# EAGLE schematic usbspi (EAGLE 9.3.0)
CREVISION: hv0a; DESIGNER: Rafael Silva
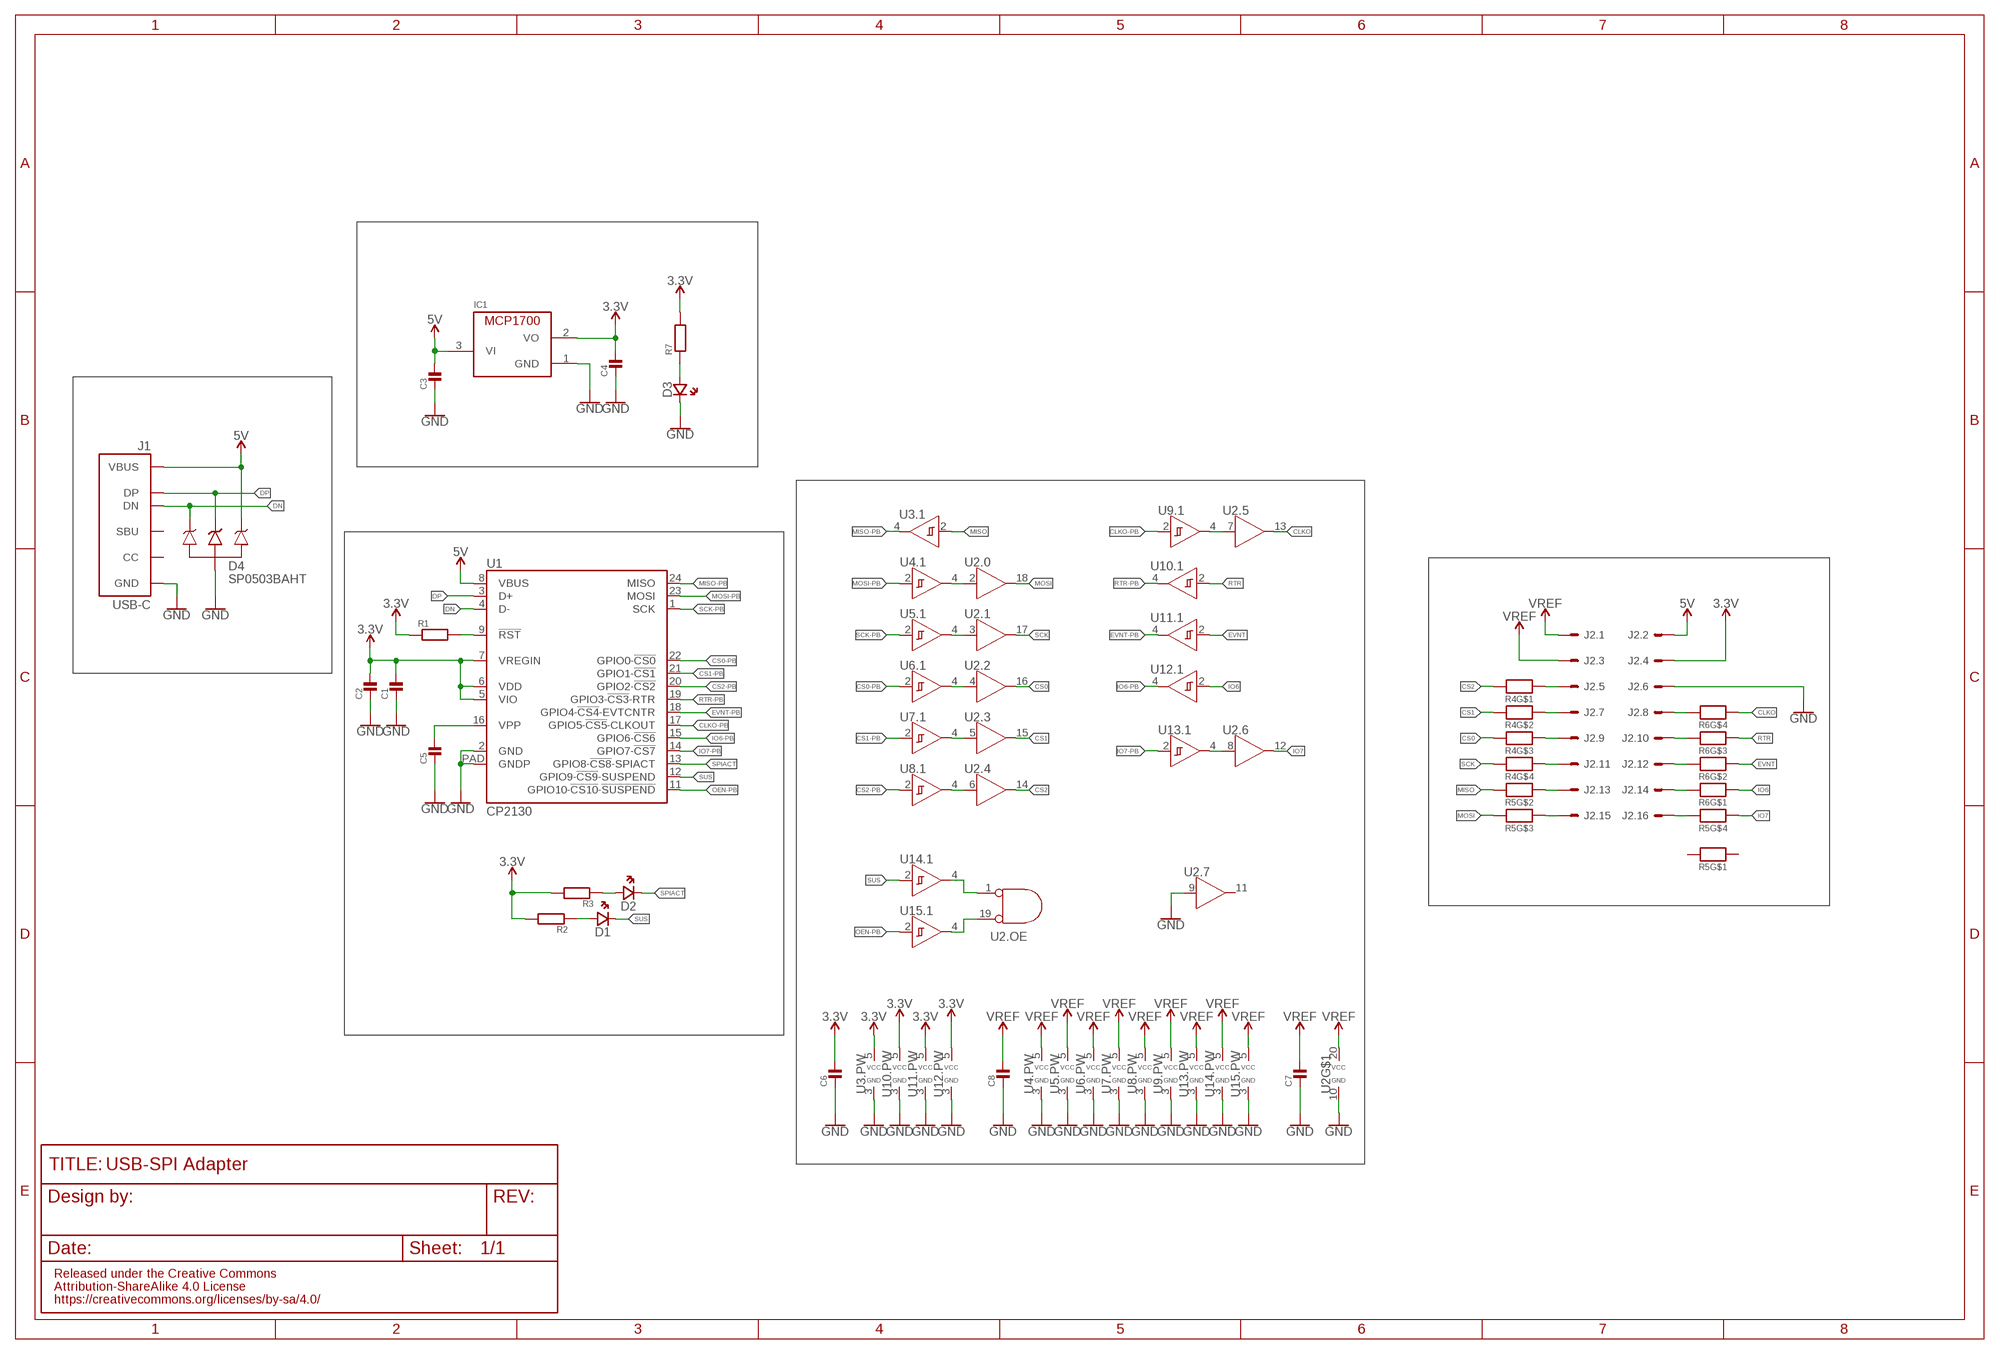
[diagram p0: schematic, sheet 1]

## Parts
C1  MLCC0603  [0603_WAVE]
C2  MLCC0603  [0603_WAVE]
C3  MLCC0603  [0603_WAVE]
C4  MLCC0603  [0603_WAVE]
C5  MLCC0603  [0603_WAVE]
C6  MLCC0603  [0603_WAVE]
C7  MLCC0603  [0603_WAVE]
C8  MLCC0603  [0603_WAVE]
D1  LED0603  [CHIPLED_0603]
D2  LED0603  [CHIPLED_0603]
D3  LED0603  [CHIPLED_0603]
D4  SP0503BAHT  [SOT143]
IC1  MCP1700T-3302TT  [SOT-23]
J1  USB-C  [USB-C]
J2  2X8  [2X8_2.54]
R1  RESISTOR0603  [0603_WAVE]
R2  RESISTOR0603  [0603_WAVE]
R3  RESISTOR0603  [0603_WAVE]
R4  RESISTOR_4PACK  [RESPACK_4X0603]
R5  RESISTOR_4PACK  [RESPACK_4X0603]
R6  RESISTOR_4PACK  [RESPACK_4X0603]
R7  RESISTOR0603  [0603_WAVE]
U1  CP2130  [QFN24]
U2  74HC541  [TSSOP20]
U3  74LVC1G17  [SC70-5]
U4  74LVC1G17  [SC70-5]
U5  74LVC1G17  [SC70-5]
U6  74LVC1G17  [SC70-5]
U7  74LVC1G17  [SC70-5]
U8  74LVC1G17  [SC70-5]
U9  74LVC1G17  [SC70-5]
U10  74LVC1G17  [SC70-5]
U11  74LVC1G17  [SC70-5]
U12  74LVC1G17  [SC70-5]
U13  74LVC1G17  [SC70-5]
U14  74LVC1G17  [SC70-5]
U15  74LVC1G17  [SC70-5]

## Nets
3.3V: C1.P$1 C2.P$1 C4.P$1 C6.P$1 IC1.2(VO) J2.4 R1.P$1 R2.P$2 R3.P$2 R7.P$2 U1.5(VIO) U1.6(VDD) U1.7(VREGIN) U3.5(.PW:VCC) U10.5(.PW:VCC) U11.5(.PW:VCC) U12.5(.PW:VCC)
5V: C3.P$1 D4.4 IC1.3(VI) J1.A4_B9(VBUS) J1.B4_A9(VBUS) J2.2 U1.8(VBUS)
CLKO: R6.4 U2.13(.5:Y)
CLKO-PB: U1.17(GPIO5-!CS5!-CLKOUT) U9.2(.1:A)
CS0: R4.6 U2.16(.2:Y)
CS0-PB: U1.22(GPIO0-!CS0) U6.2(.1:A)
CS1: R4.7 U2.15(.3:Y)
CS1-PB: U1.21(GPIO1-!CS1) U7.2(.1:A)
CS2: R4.8 U2.14(.4:Y)
CS2-PB: U1.20(GPIO2-!CS2) U8.2(.1:A)
DN: D4.2 J1.A7(DN) J1.B7(DN) U1.4(D-)
DP: D4.3 J1.A6(DP) J1.B6(DP) U1.3(D+)
EVNT: R6.2 U11.2(.1:A)
EVNT-PB: U1.18(GPIO4-!CS4!-EVTCNTR) U11.4(.1:Y)
GND: C1.P$2 C2.P$2 C3.P$2 C4.P$2 C5.P$2 C6.P$2 C7.P$2 C8.P$2 D3.C(CA) D4.1 IC1.1(GND) J1.A1_B12(GND) J1.B1_A12(GND) J1.SHIELD@0(GND) J1.SHIELD@1(GND) J2.6 U1.2(GND) U1.PAD(GNDP) U2.9(.7:A) U2.10(GND) U3.3(.PW:GND) U4.3(.PW:GND) U5.3(.PW:GND) U6.3(.PW:GND) U7.3(.PW:GND) U8.3(.PW:GND) U9.3(.PW:GND) U10.3(.PW:GND) U11.3(.PW:GND) U12.3(.PW:GND) U13.3(.PW:GND) U14.3(.PW:GND) U15.3(.PW:GND)
IO6: R6.1 U12.2(.1:A)
IO6-PB: U1.15(GPIO6-!CS6) U12.4(.1:Y)
IO7: R5.4 U2.12(.6:Y)
IO7-PB: U1.14(GPIO7-!CS7) U13.2(.1:A)
MISO: R5.7 U3.2(.1:A)
MISO-PB: U1.24(MISO) U3.4(.1:Y)
MOSI: R5.6 U2.18(.0:Y)
MOSI-PB: U1.23(MOSI) U4.2(.1:A)
N$1: U2.19(.OE:B) U15.4(.1:Y)
N$2: D1.A(AN) R2.P$1
N$3: D2.A(AN) R3.P$1
N$4: R1.P$2 U1.9(!RST)
N$5: U2.1(.OE:A) U14.4(.1:Y)
N$6: J2.13 R5.2
N$7: U2.2(.0:A) U4.4(.1:Y)
N$8: C5.P$1 U1.16(VPP)
N$9: D3.A(AN) R7.P$1
N$10: U2.3(.1:A) U5.4(.1:Y)
N$11: U2.4(.2:A) U6.4(.1:Y)
N$12: U2.5(.3:A) U7.4(.1:Y)
N$13: U2.6(.4:A) U8.4(.1:Y)
N$14: U2.8(.6:A) U13.4(.1:Y)
N$15: U2.7(.5:A) U9.4(.1:Y)
N$16: J2.15 R5.3
N$17: J2.11 R4.4
N$18: J2.9 R4.3
N$19: J2.7 R4.2
N$20: J2.5 R4.1
N$21: J2.8 R6.5
N$22: J2.10 R6.6
N$23: J2.12 R6.7
N$24: J2.14 R6.8
N$25: J2.16 R5.5
OEN-PB: U1.11(GPIO10-!CS10!-!SUSPEND) U15.2(.1:A)
RTR: R6.3 U10.2(.1:A)
RTR-PB: U1.19(GPIO3-!CS3!-RTR) U10.4(.1:Y)
SCK: R4.5 U2.17(.1:Y)
SCK-PB: U1.1(SCK) U5.2(.1:A)
SPIACT: D2.C(CA) U1.13(GPIO8-!CS8!-SPIACT)
SUS: D1.C(CA) U1.12(GPIO9-!CS9!-SUSPEND) U14.2(.1:A)
VREF: C7.P$1 C8.P$1 J2.1 J2.3 U2.20(VCC) U4.5(.PW:VCC) U5.5(.PW:VCC) U6.5(.PW:VCC) U7.5(.PW:VCC) U8.5(.PW:VCC) U9.5(.PW:VCC) U13.5(.PW:VCC) U14.5(.PW:VCC) U15.5(.PW:VCC)
Unconnected: J1.A5(CC) J1.A8(SBU) J1.B5(CC) J1.B8(SBU) R5.1 R5.8 U2.11(.7:Y)

## Notes on the sheet
- USB-SPI Adapter

## Library data of the parts
C1-C8 = Passive Components > Capacitors > Multilayer Ceramic Capacitors MLCC:MLCC: KEMET’s X7R dielectric features a 125°C maximum operating temperature and is considered temperature stable. The Electronics Components, Assemblies and Materials Association (EIA) characterizes X7R dielectric as a Class II material. Components of this classification are fixed, ceramic dielectric capacitors suited for bypass and decoupling applications or for frequency discriminating circuits where Q and stability of capacitance characteristics are not critical. X7R exhibits a predictable change in capacitance with respect to time and voltage, boasting a minimal change in capacitance with reference to ambient temperature. Capacitance change is limited to ±15% from −55°C to +125°C.
D1-D3 = Opto-electronics > LED Emitters:LED: LED 0603 - 0603 Surface Mount Package 2mA: Green LED - Low Power (3.9mcd, 2ma, 1.7Vf) - Digikey: 475-2709-2-ND Orange LED - Low Power (9.8mcd, 2ma, 1.8Vf) - Digikey: 475-1194-2-ND Red LED - Low Power (5mcd, 2ma, 1.8Vf) - Digikey: 475-1195-2-ND Yellow LED - Low Power (7mcd, 2ma, 1.8Vf) - Digikey: 475-1196-2-ND 5mA: Blue LED - Low Power (17mcd, 5ma, 2.9Vf) - Digikey: LNJ937W8CRACT-ND 0805 - 0805 Surface Mount Package 2mA: Red LED (8.8mcd, 2mA, 1.8Vf, Clear) - Low Power [Digikey: 475-2510-1-ND] Green LED (5mcd, 2mA, 1.8Vf, Clear) - Low Power [Digikey: 475-2730-1-ND] Yellow LED (11.3mcd, 2mA, 1.8Vf, Clear) - Low Power [Digikey: 475-2555-1-ND] 20mA: Red LED (104mcd, 20mA, Diffused) - LS R976 [Digikey: 475-1278-6-ND] Red LED (12mcd, 20mA, 2.0Vf, Clear) - APT2012EC [Digikey: 754-1128-1-ND] Green LED (15mcd, 20mA, 2.2Vf, Clear) - APT2012GC [Digikey: 754-1131-1-ND] Orange LED (160mcd, 20mA, 2.1Vf, Clear) - APT2012SECK [Digikey: 754-1130-1-ND] 1206 - 1206 Surface Mount Package Green LED (26mcd, 20mA, Diffused) - LG N971 [Digikey: 475-1407-6-ND] Red LED (15mcd, 20mA, Diffused) - LH N974 [Digikey: 475-1416-6-ND] Cree - Cree High-Power Surface Mount LEDs XPEBWT-L1-0000-00D50 - White 111lm 350mA 2.9Vf 6200K 110° XTEAWT-00-0000-00000LEE3 - White 114lm 350mA 2.85Vf 5000K 115° Everlight - Everlight 45-21 Series Surface Mount LEDs 45-21/QK2C-B2832AC2CB2/2T - Warm White 2000mcd 20mA 3.25Vf 3050K 120° 45-21/LK2C-B38452C4CB2/2T - Nuetral White 2000mcd 20mA 3.25Vf 4150K 120° 45-21/LK2C-B50634C6CB2/2T - Cold White 2200mcd 20mA 3.25Vf 5650K 120° PLCC2 Reverse Mount LS T77K-J1L2-1-0-2-R18-Z - Red 11.25mcd 2mA 1.8Vf 630nm 120° LO T77K-L1M2-24-Z - Orange 19.6mcd 2mA 1.8Vf 606nm 120° LY T77K-K2M1-26-Z - Yellow 15.7mcd 2mA 1.8Vf 587nm 120°
D4 = Circuit Protection > ESD Suppressors \ TVS Diodes:SP0503BAHT
IC1 = Power > LDO Voltage Regulators:MCP1700
J1 = Connectors > USB:USB-C
J2 = Connectors > Header:2X8
R1-R3 R7 = Passive Components > Resistors > Chip Resistors:RESISTOR: Resistors For new designs, use the packages preceded by an '_' character since they are more reliable: The following footprints should be used on most boards: _0402 - Standard footprint for regular board layouts _0603 - Standard footprint for regular board layouts _0805 - Standard footprint for regular board layouts _1206 - Standard footprint for regular board layouts For extremely tight-pitch boards where space is at a premium, the following 'micro-pitch' footprints can be used (smaller pads, no silkscreen outline, etc.): _0402MP - Micro-pitch footprint for very dense/compact boards _0603MP - Micro-pitch footprint for very dense/compact boards _0805MP - Micro-pitch footprint for very dense/compact boards _1206MP - Micro-pitch footprint for very dense/compact boards
R4-R6 = Passive Components > Resistors > Resistor Networks & Arrays:RESISTOR_4PACK: Resistor Packs (4 resistors) 4 x 0603 10K 1/16W - Digikey: YC164J-10KCT-ND
U1 = Semiconductors > Integrated Circuits - ICs > Interface ICs > USB Interface IC:CP2130: SINGLE-CHIP USB-TO-SPI BRIDGE
U2 = Semiconductors > Integrated Circuits - ICs > Logic ICs > Logic Gates:74HC541
U3-U15 = Semiconductors > Integrated Circuits - ICs > Logic ICs > Logic Gates:74LVC1G17